# EAGLE design PCB_for_ADXL345 (EAGLE 9.6.2)
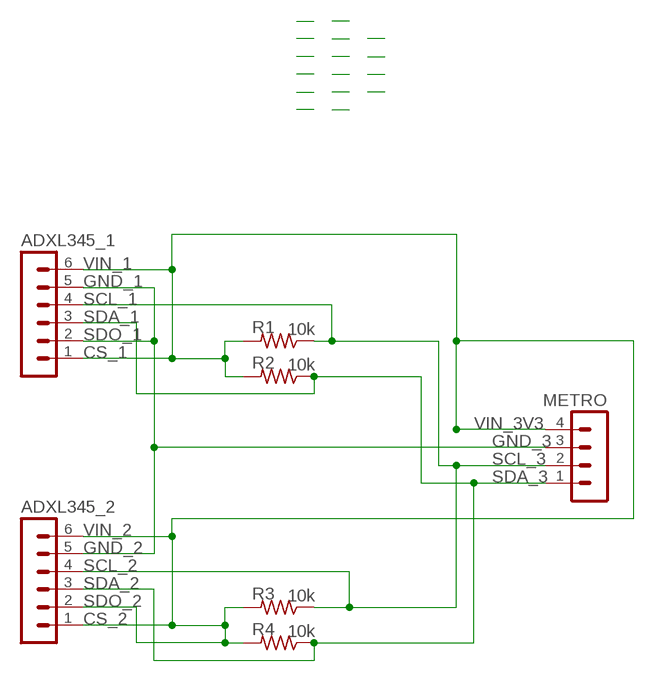
[diagram p0: schematic, sheet 1]

## Parts
ADXL345_1  MA06-1  [MA06-1]
ADXL345_2  MA06-1  [MA06-1]
METRO  MA04-1  [MA04-1]
R1  10k  R-US_0207/10  [0207/10]
R2  10k  R-US_0207/10  [0207/10]
R3  10k  R-US_0207/10  [0207/10]
R4  10k  R-US_0207/10  [0207/10]

## Nets
GND: ADXL345_1.2 ADXL345_1.5 ADXL345_2.5 METRO.3
N$4: ADXL345_1.3 ADXL345_2.3 METRO.1 R2.1 R4.1
N$5: ADXL345_1.4 ADXL345_2.4 METRO.2 R1.1 R3.1
VIN: ADXL345_1.1 ADXL345_1.6 ADXL345_2.1 ADXL345_2.2 ADXL345_2.6 METRO.4 R1.2 R2.2 R3.2 R4.2

## Library data of the parts
ADXL345_1 ADXL345_2 = con-lstb:MA06-1: PIN HEADER; OC_FARNELL: unknown; OC_NEWARK: unknown
METRO = con-lstb:MA04-1: PIN HEADER; OC_FARNELL: unknown; OC_NEWARK: unknown
R1-R4 = rcl:R-US_: RESISTOR, American symbol; SPICEPREFIX: R

## Net classes
0 default: width 0.508 mm, drill 0.508 mm, clearance 1.016 mm

## Board
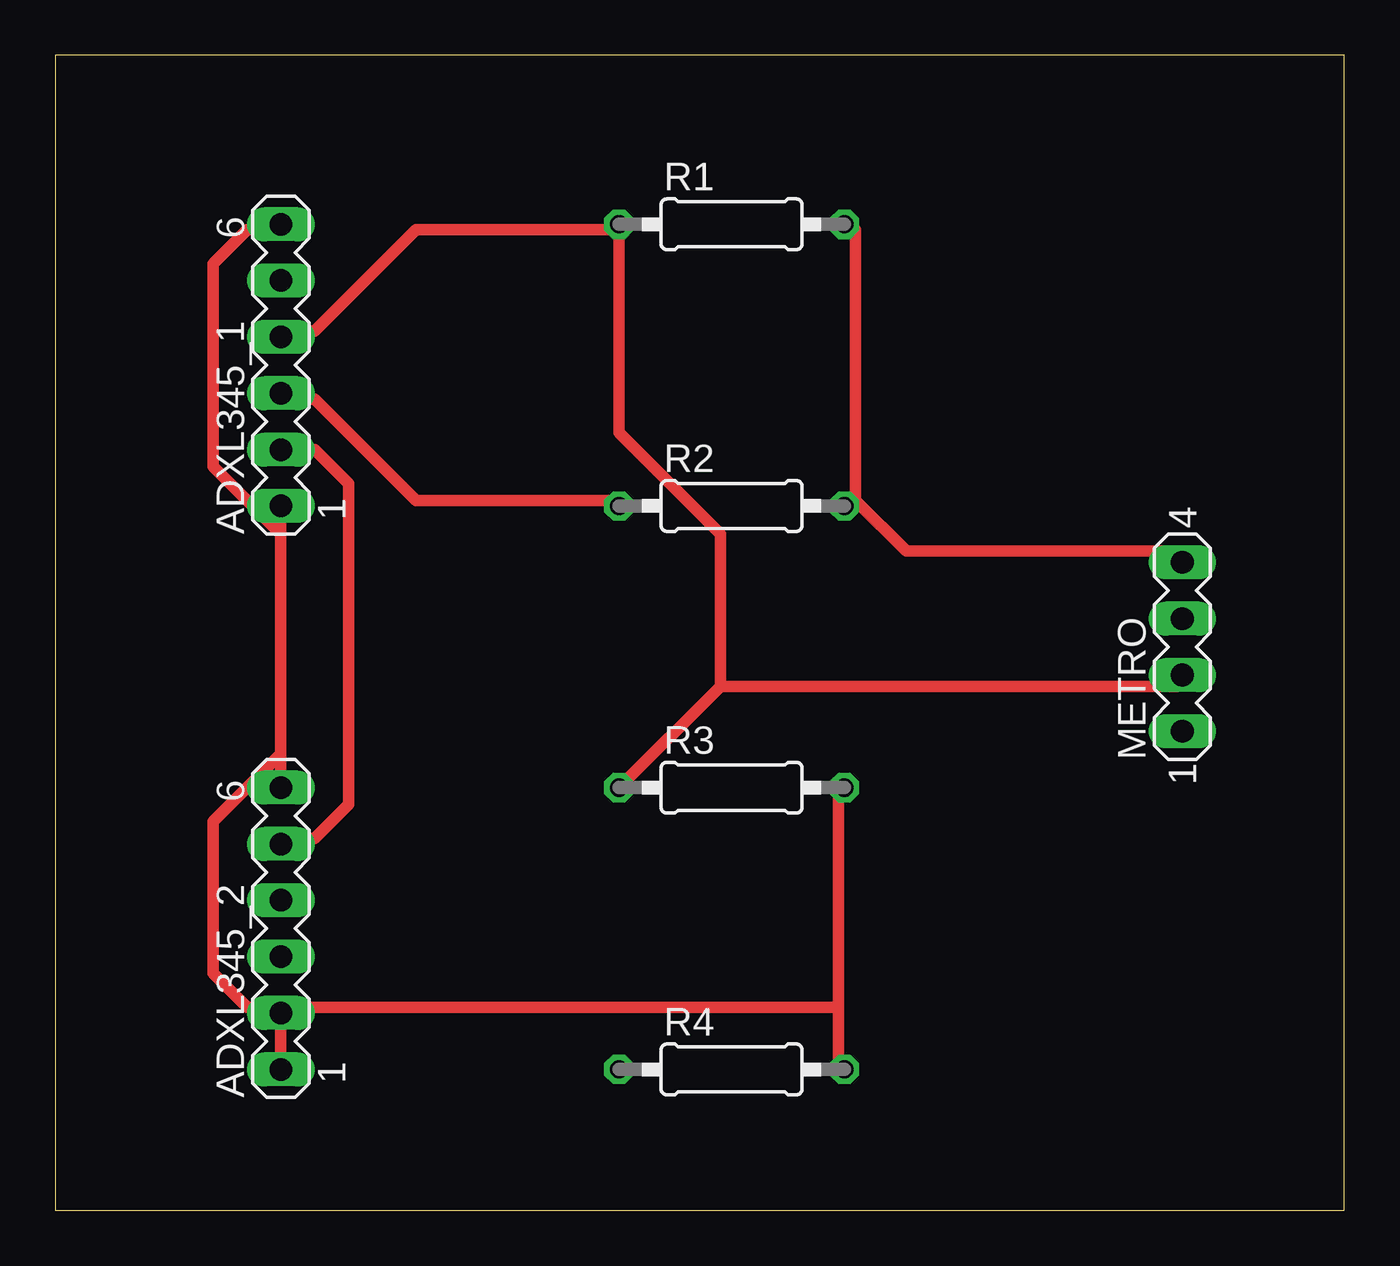
[diagram p1: board, top side]
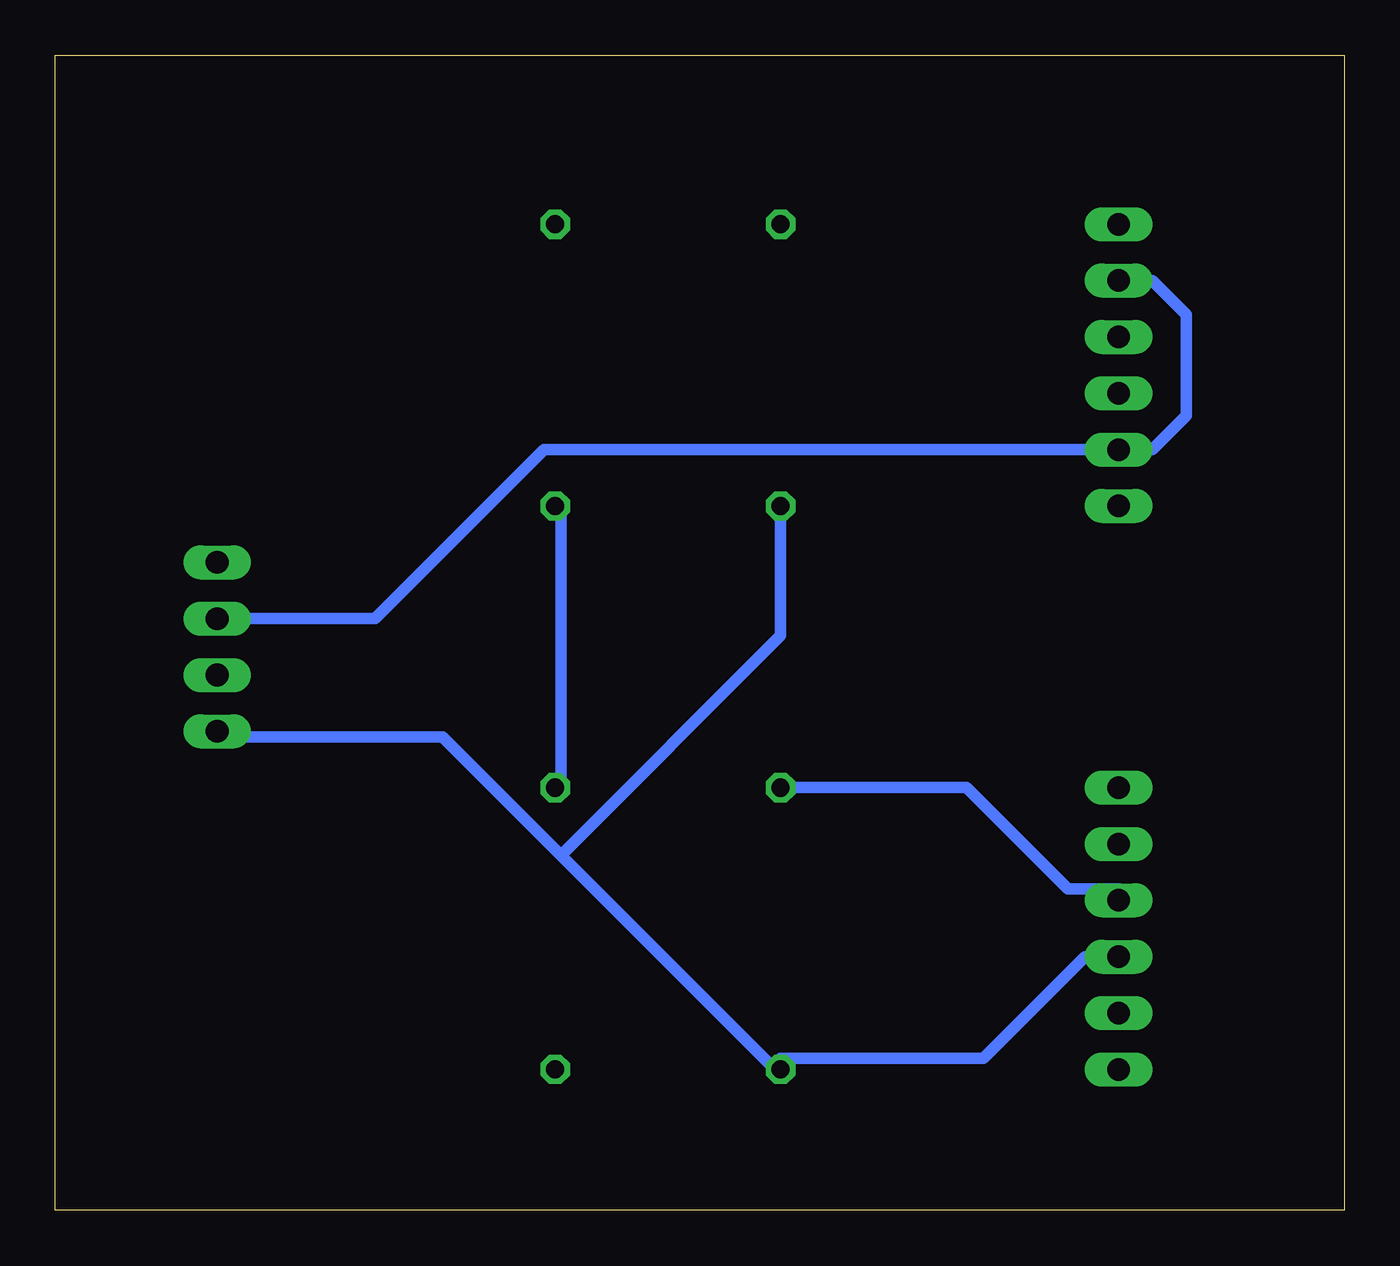
[diagram p2: board, bottom side, seen from below]

Size 58.09 x 52.06 mm. Coordinates in mm from the lower left corner, seen from the top.
Outline: 0,0 58.09,0 58.09,52.06 0,52.06 0,0
Copper layers (1*16): Top 0.035mm / dielectric 1.5mm / Bottom 0.035mm
Design rules "default": minimum track width 6mil, minimum drill 0.35mm, track to track 6mil, track to pad 6mil, pad to pad 6mil, via to via 6mil, smd to smd 6mil, copper to edge 40mil, drill to drill 6mil, minimum pad ring 10mil, minimum via ring 8mil, stop-mask expansion 4mil, vias tented up to drill 0mil, thermal gap 10mil

### Footprints (pad centres in the part's own frame; a part is rotated, then mirrored left to right if it is on the bottom)
MA06-1 = drill 1.016 long: 1 -6.35,0; 2 -3.81,0; 3 -1.27,0; 4 1.27,0; 5 3.81,0; 6 6.35,0
MA04-1 = drill 1.016 long: 1 -3.81,0; 2 -1.27,0; 3 1.27,0; 4 3.81,0
0207/10 = drill 0.813 octagon: 1 -5.08,0; 2 5.08,0

### Placement (x,y rotation side)
ADXL345_1  10.16,38.1 90 top
ADXL345_2  10.16,12.7 90 top
METRO  50.8,25.4 90 top
R1  30.48,44.45 0 top
R2  30.48,31.75 0 top
R3  30.48,19.05 0 top
R4  30.48,6.35 0 top

### Tracks (layer width: path | path; a pad name or v marks a point on that pad's centre or on a via)
GND
  Top 0.508: ADXL345_1.2 11.68,34.29 13.21,32.77 13.21,18.29 11.68,16.76 10.16,16.76 ADXL345_2.5
  Bottom 0.508: ADXL345_1.5 8.64,41.91 7.11,40.39 7.11,35.81 8.64,34.29 ADXL345_1.2 36.07,34.29 43.69,26.67 METRO.3
N$4
  Top 0.508: R2.1 25.4,32 16.26,32 11.68,36.58 10.16,36.58 ADXL345_1.3
  Bottom 0.508: ADXL345_2.3 11.68,11.43 16.26,6.86 25.4,6.86 R4.1 25.4,6.1 35.31,16 | 35.31,16 40.64,21.34 50.55,21.34 METRO.1 | R2.1 25.4,25.91 35.31,16
N$5
  Top 0.508: 25.4,44.2 16.26,44.2 11.68,39.62 10.16,39.62 ADXL345_1.4 | 29.97,23.62 50.55,23.62 METRO.2 | R3.1 29.97,23.62 | 25.4,44.2 25.4,35.05 29.97,30.48 29.97,23.62 | 25.4,44.2 R1.1
  Bottom 0.508: R3.1 17.02,19.05 12.45,14.48 10.16,14.48 ADXL345_2.4
VIN
  Top 0.508: ADXL345_2.1 ADXL345_2.2 10.16,9.14 | ADXL345_1.1 10.16,30.48 | 10.16,30.48 10.16,20.57 | 10.16,20.57 ADXL345_2.6 | 10.16,30.48 7.11,33.53 7.11,42.67 8.64,44.2 10.16,44.2 ADXL345_1.6 | 10.16,9.14 8.64,9.14 7.11,10.67 7.11,17.53 10.16,20.57 | 35.31,9.14 35.31,19.05 R3.2 | 35.31,9.14 35.31,6.86 R4.2 | 36.07,32 36.07,44.2 R1.2 | 36.07,32 38.35,29.72 50.55,29.72 METRO.4 | 36.07,32 R2.2 | 35.31,9.14 10.16,9.14
  Bottom 0.508: R3.2 35.31,19.05 35.31,31.24 R2.2